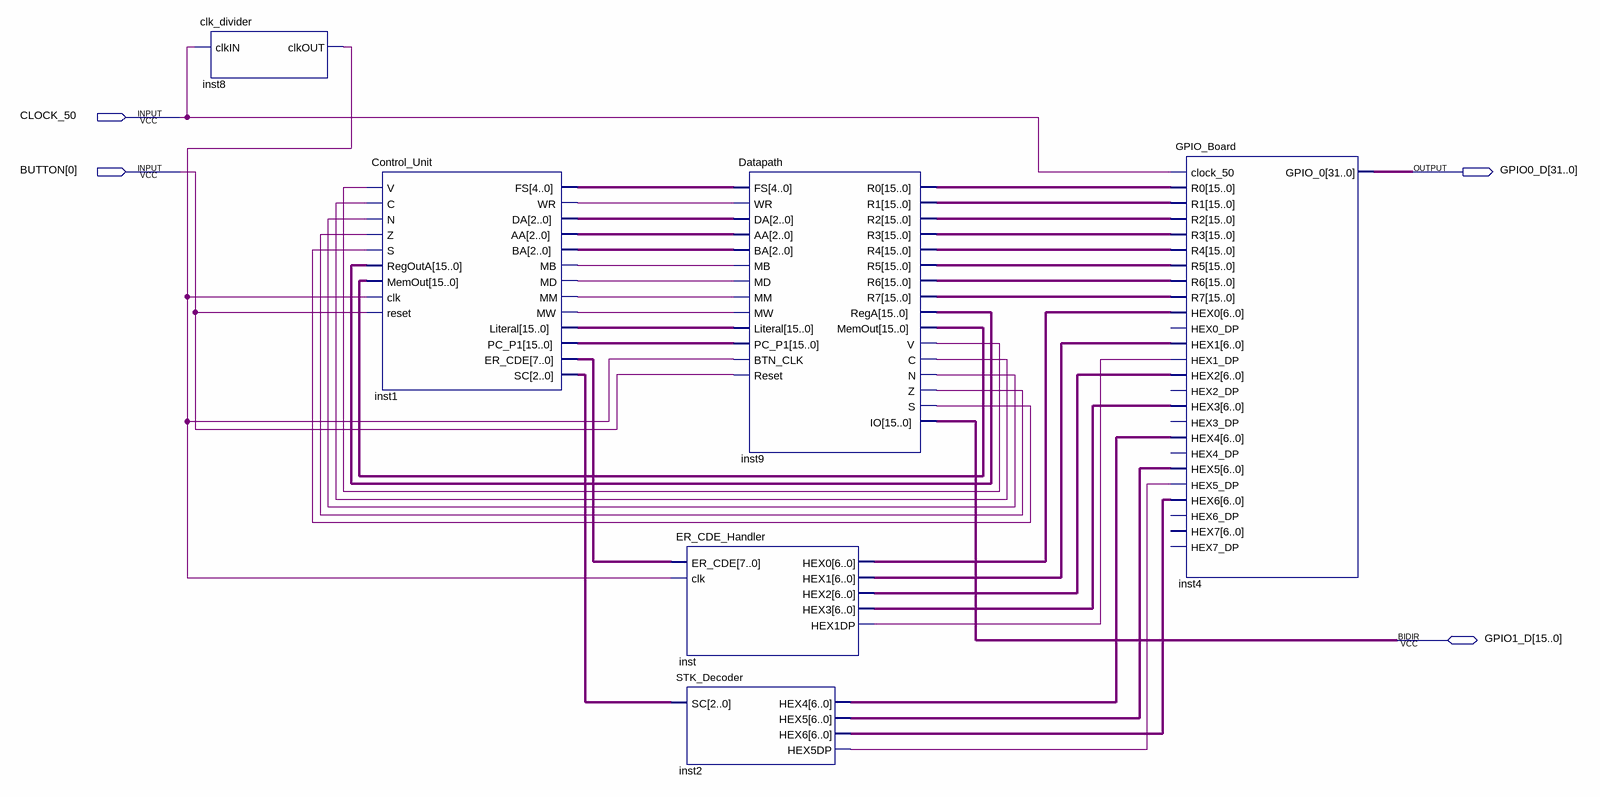
[diagram p0: schematic sheet]
// Quartus schematic Processor.bdf as structural Verilog: 6 symbols, 4 pins
module Processor (
  input  CLOCK_50,
  input  [0:0] BUTTON,
  inout  [15:0] GPIO1_D,
  output [31:0] GPIO0_D
);

  wire inst1_mb, inst1_md, inst1_mm, inst1_mw, inst1_wr, inst2_hex5dp, inst8_clkout, inst9_c, inst9_n,
       inst9_s, inst9_v, inst9_z, inst_hex1dp;
  wire [2:0] inst1_aa, inst1_ba, inst1_da, inst1_sc;
  wire [4:0] inst1_fs;
  wire [6:0] inst2_hex4, inst2_hex5, inst2_hex6, inst_hex0, inst_hex1, inst_hex2, inst_hex3;
  wire [7:0] inst1_er_cde;
  wire [15:0] inst1_literal, inst1_pc_p1, inst9_memout, inst9_r0, inst9_r1, inst9_r2, inst9_r3, inst9_r4,
       inst9_r5, inst9_r6, inst9_r7, inst9_rega;

  clk_divider inst8 (.clkIN(CLOCK_50), .clkOUT(inst8_clkout));
  Control_Unit inst1 (
    .V(inst9_v), .C(inst9_c), .N(inst9_n), .Z(inst9_z), .S(inst9_s), .RegOutA(inst9_rega),
    .MemOut(inst9_memout), .clk(inst8_clkout), .reset(BUTTON[0]), .FS(inst1_fs), .WR(inst1_wr),
    .DA(inst1_da), .AA(inst1_aa), .BA(inst1_ba), .MB(inst1_mb), .MD(inst1_md), .MM(inst1_mm), .MW(inst1_mw),
    .Literal(inst1_literal), .PC_P1(inst1_pc_p1), .ER_CDE(inst1_er_cde), .SC(inst1_sc));
  ER_CDE_Handler inst (
    .ER_CDE(inst1_er_cde), .clk(inst8_clkout), .HEX0(inst_hex0), .HEX1(inst_hex1), .HEX2(inst_hex2),
    .HEX3(inst_hex3), .HEX1DP(inst_hex1dp));
  STK_Decoder inst2 (.SC(inst1_sc), .HEX4(inst2_hex4), .HEX5(inst2_hex5), .HEX6(inst2_hex6), .HEX5DP(inst2_hex5dp));
  Datapath inst9 (
    .WR(inst1_wr), .DA(inst1_da), .AA(inst1_aa), .BA(inst1_ba), .Literal(inst1_literal), .MD(inst1_md),
    .MB(inst1_mb), .FS(inst1_fs), .MM(inst1_mm), .BTN_CLK(inst8_clkout), .Reset(BUTTON[0]), .MW(inst1_mw),
    .PC_P1(inst1_pc_p1), .R0(inst9_r0), .R1(inst9_r1), .R2(inst9_r2), .R3(inst9_r3), .R4(inst9_r4),
    .R5(inst9_r5), .R6(inst9_r6), .R7(inst9_r7), .RegA(inst9_rega), .MemOut(inst9_memout), .V(inst9_v),
    .C(inst9_c), .N(inst9_n), .Z(inst9_z), .S(inst9_s), .IO(GPIO1_D));
  GPIO_Board inst4 (
    .clock_50(CLOCK_50), .R0(inst9_r0), .R1(inst9_r1), .R2(inst9_r2), .R3(inst9_r3), .R4(inst9_r4),
    .R5(inst9_r5), .R6(inst9_r6), .R7(inst9_r7), .HEX0(inst_hex0), .HEX1(inst_hex1), .HEX1_DP(inst_hex1dp),
    .HEX2(inst_hex2), .HEX3(inst_hex3), .HEX4(inst2_hex4), .HEX5(inst2_hex5), .HEX5_DP(inst2_hex5dp),
    .HEX6(inst2_hex6), .GPIO_0(GPIO0_D));  // open: HEX0_DP, HEX2_DP, HEX3_DP, HEX4_DP, HEX6_DP, HEX7, HEX7_DP
endmodule
